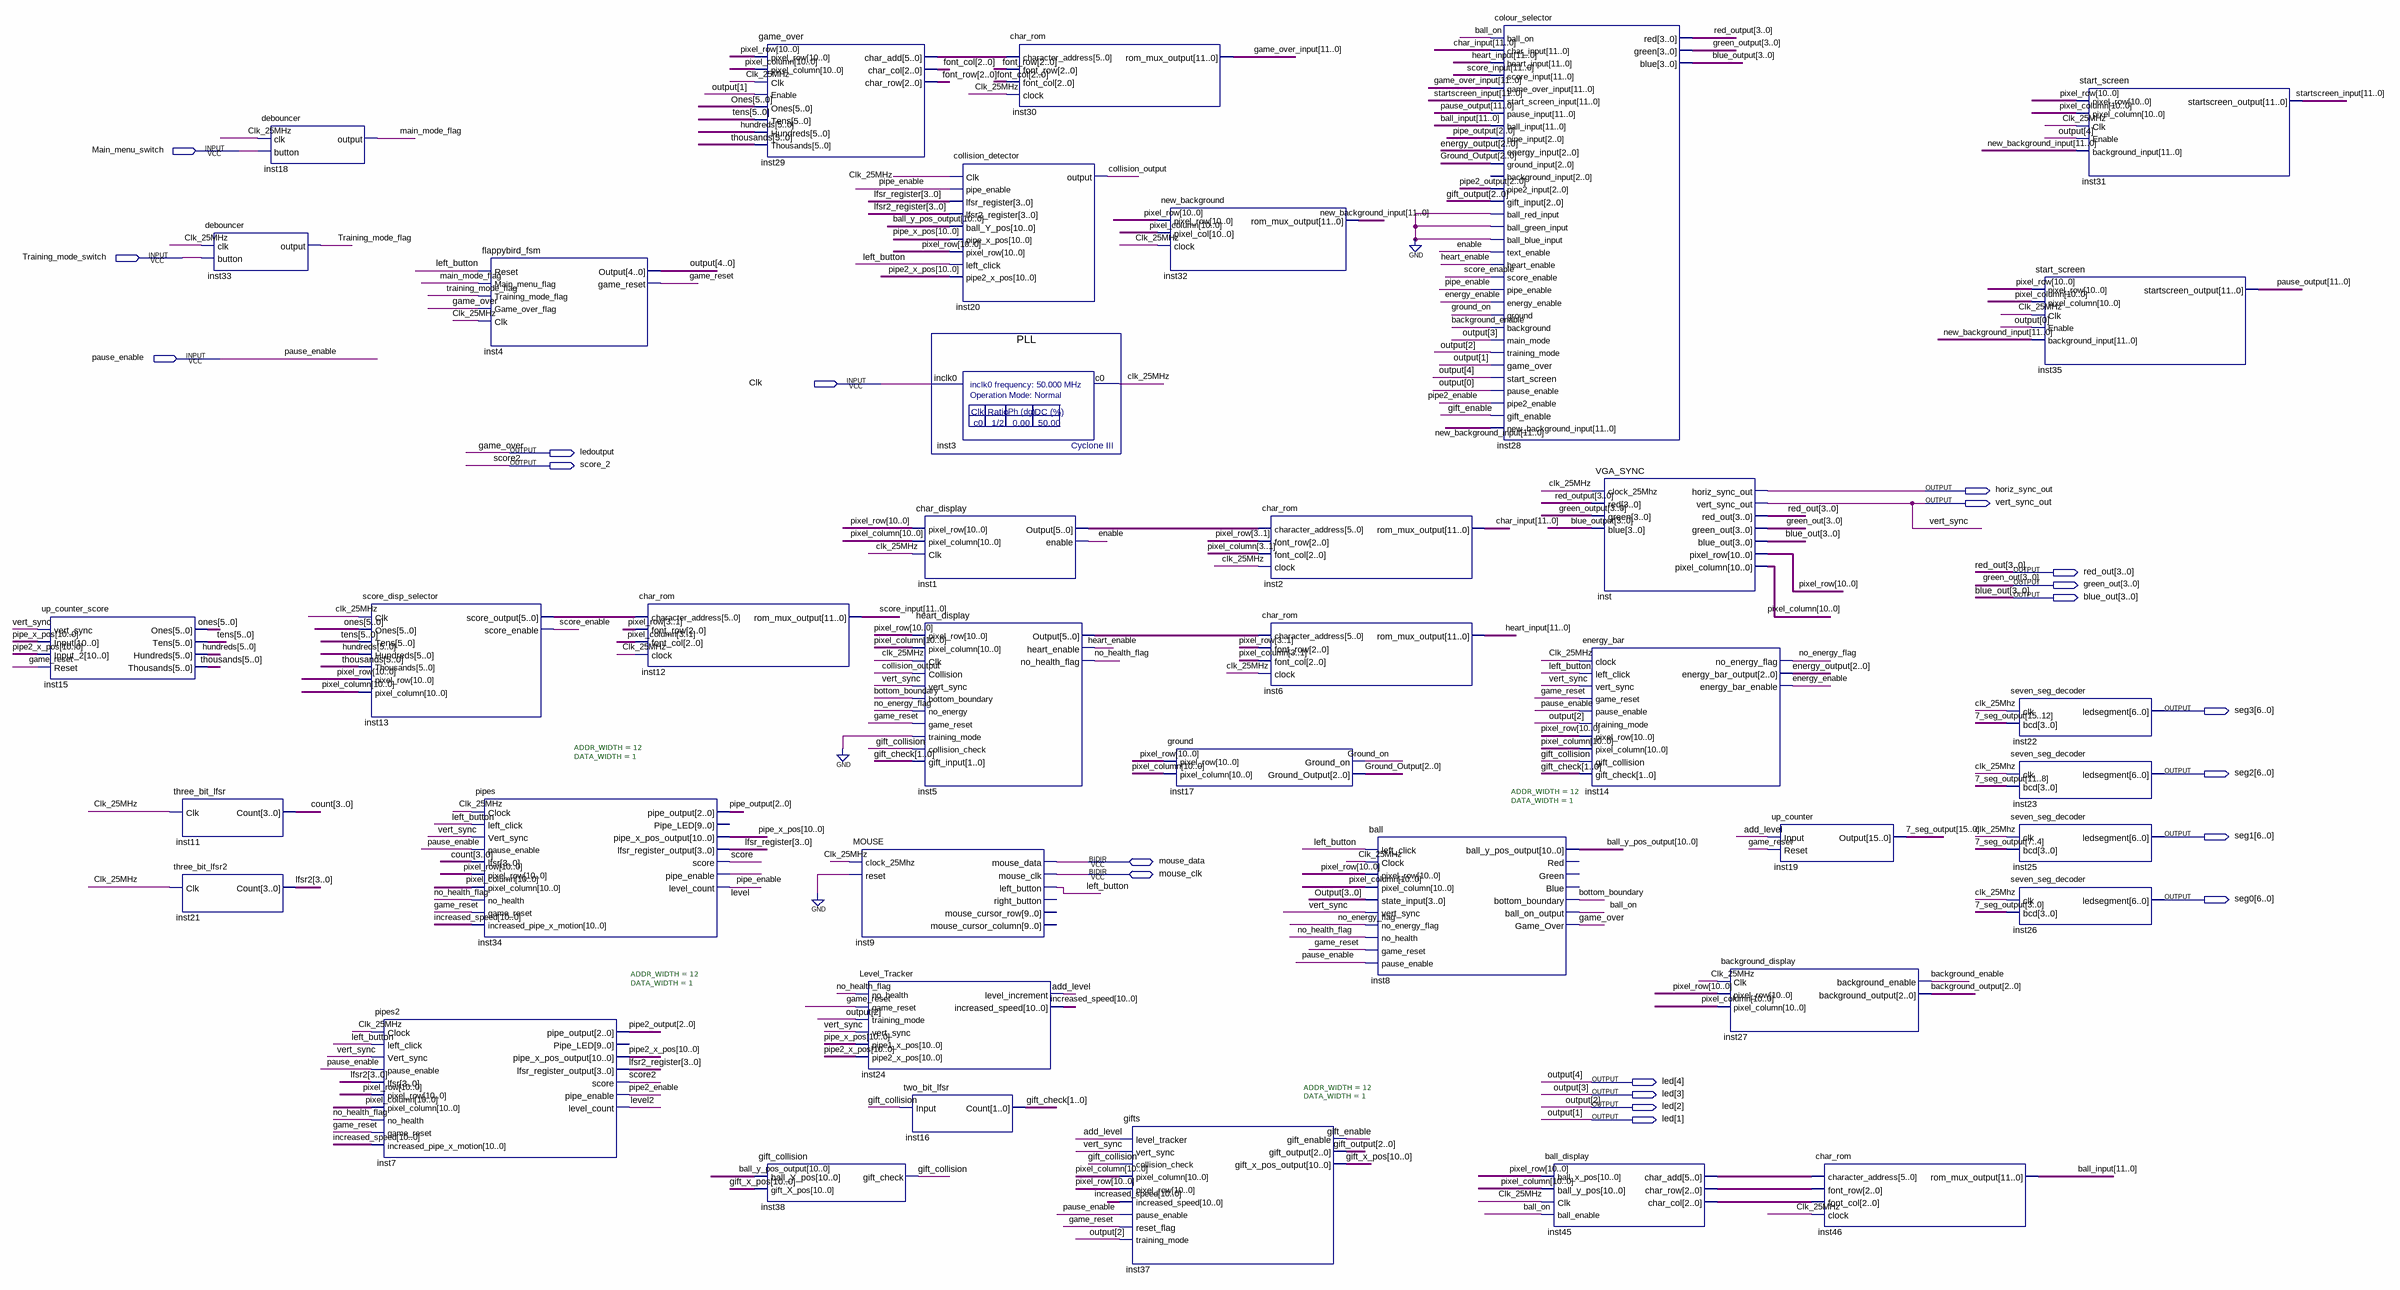
[diagram p0: schematic sheet]
// Quartus schematic Flappy_bird.bdf as structural Verilog: 39 symbols, 21 pins
module Flappy_bird (
  input  Main_menu_switch,
  input  Training_mode_switch,
  input  pause_enable,
  input  Clk,
  inout  mouse_data,
  inout  mouse_clk,
  output ledoutput,
  output score_2,
  output horiz_sync_out,
  output vert_sync_out,
  output [3:0] red_out,
  output [3:0] green_out,
  output [3:0] blue_out,
  output [6:0] seg3,
  output [6:0] seg2,
  output [6:0] seg1,
  output [6:0] seg0,
  output [4:1] led
);

  wire add_level, background_enable, ball_on, bottom_boundary, clk_25MHz, collision_output, enable,
       energy_enable, game_reset, gift_collision, gift_enable, Ground_on, heart_enable, left_button, level,
       level2, main_mode_flag, no_energy_flag, no_health_flag, pipe2_enable, pipe_enable, score,
       score_enable, Training_mode_flag;
  wire [0:0] Output;
  wire [1:0] gift_check;
  wire [2:0] background_output, energy_output, font_col, font_row, gift_output, Ground_Output,
       inst45_char_col, inst45_char_row, pipe2_output, pipe_output;
  wire [3:0] blue_output, count, green_output, lfsr2, lfsr2_register, lfsr_register, red_output;
  wire [5:0] hundreds, inst1_output, inst5_output, inst13_score_output, inst29_char_add, inst45_char_add,
       ones, tens, thousands;
  wire [10:0] ball_y_pos_output, gift_x_pos, increased_speed, pipe2_x_pos, pipe_x_pos, pixel_column,
       pixel_row;
  wire [11:0] ball_input, char_input, game_over_input, heart_input, new_background_input, pause_output,
       score_input, startscreen_input;
  wire [15:0] \7_seg_output ;

  up_counter_score inst15 (
    .vert_sync(vert_sync_out), .Input(pipe_x_pos), .Input_2(pipe2_x_pos), .Reset(game_reset), .Ones(ones),
    .Tens(tens), .Hundreds(hundreds), .Thousands(thousands));
  debouncer inst33 (.clk(clk_25MHz), .button(Training_mode_switch), .\output (Training_mode_flag));
  three_bit_lfsr inst11 (.Clk(clk_25MHz), .Count(count));
  three_bit_lfsr2 inst21 (.Clk(clk_25MHz), .Count(lfsr2));
  debouncer inst18 (.clk(clk_25MHz), .button(Main_menu_switch), .\output (main_mode_flag));
  score_disp_selector inst13 (
    .Clk(clk_25MHz), .Ones(ones), .Tens(tens), .Hundreds(hundreds), .Thousands(thousands),
    .pixel_row(pixel_row), .pixel_column(pixel_column), .score_output(inst13_score_output),
    .score_enable(score_enable));
  pipes2 #(.ADDR_WIDTH(12), .DATA_WIDTH(1)) inst7 (
    .Clock(clk_25MHz), .left_click(left_button), .Vert_sync(vert_sync_out), .pause_enable(pause_enable),
    .lfsr(lfsr2), .pixel_row(pixel_row), .pixel_column(pixel_column), .no_health(no_health_flag),
    .game_reset(game_reset), .increased_pipe_x_motion(increased_speed), .pipe_output(pipe2_output),
    .pipe_x_pos_output(pipe2_x_pos), .lfsr_register_output(lfsr2_register), .score(score_2),
    .pipe_enable(pipe2_enable), .level_count(level2));  // open: Pipe_LED
  flappybird_fsm inst4 (
    .Reset(left_button), .Main_menu_flag(main_mode_flag), .Training_mode_flag(Training_mode_flag),
    .Game_over_flag(ledoutput), .Clk(clk_25MHz), .Output({led, Output[0]}), .game_reset(game_reset));
  pipes #(.ADDR_WIDTH(12), .DATA_WIDTH(1)) inst34 (
    .Clock(clk_25MHz), .left_click(left_button), .Vert_sync(vert_sync_out), .pause_enable(pause_enable),
    .lfsr(count), .pixel_row(pixel_row), .pixel_column(pixel_column), .no_health(no_health_flag),
    .game_reset(game_reset), .increased_pipe_x_motion(increased_speed), .pipe_output(pipe_output),
    .pipe_x_pos_output(pipe_x_pos), .lfsr_register_output(lfsr_register), .score(score),
    .pipe_enable(pipe_enable), .level_count(level));  // open: Pipe_LED
  char_rom inst12 (
    .character_address(inst13_score_output), .font_row(pixel_row[3:1]), .font_col(pixel_column[3:1]),
    .clock(clk_25MHz), .rom_mux_output(score_input));
  game_over inst29 (
    .pixel_row(pixel_row), .pixel_column(pixel_column), .Clk(clk_25MHz), .Enable(led[1]), .Ones(ones),
    .Tens(tens), .Hundreds(hundreds), .Thousands(thousands), .char_add(inst29_char_add), .char_col(font_col),
    .char_row(font_row));
  gift_collision inst38 (.ball_Y_pos(ball_y_pos_output), .gift_X_pos(gift_x_pos), .gift_check(gift_collision));
  MOUSE inst9 (
    .clock_25Mhz(clk_25MHz), .reset(1'b0), .left_button(left_button), .mouse_data(mouse_data),
    .mouse_clk(mouse_clk));  // open: right_button, mouse_cursor_row, mouse_cursor_column
  Level_Tracker inst24 (
    .no_health(no_health_flag), .game_reset(game_reset), .training_mode(led[2]), .vert_sync(vert_sync_out),
    .pipe1_x_pos(pipe_x_pos), .pipe2_x_pos(pipe2_x_pos), .level_increment(add_level),
    .increased_speed(increased_speed));
  two_bit_lfsr inst16 (.Input(gift_collision), .Count(gift_check));
  collision_detector inst20 (
    .Clk(clk_25MHz), .pipe_enable(pipe_enable), .lfsr_register(lfsr_register),
    .lfsr2_register(lfsr2_register), .ball_Y_pos(ball_y_pos_output), .pipe_x_pos(pipe_x_pos),
    .pixel_row(pixel_row), .left_click(left_button), .pipe2_x_pos(pipe2_x_pos), .\output (collision_output));
  PLL inst3 (.inclk0(Clk), .c0(clk_25MHz));
  char_display inst1 (
    .pixel_row(pixel_row), .pixel_column(pixel_column), .Clk(clk_25MHz), .Output(inst1_output),
    .enable(enable));
  heart_display inst5 (
    .pixel_row(pixel_row), .pixel_column(pixel_column), .Clk(clk_25MHz), .Collision(collision_output),
    .vert_sync(vert_sync_out), .bottom_boundary(bottom_boundary), .no_energy(no_energy_flag),
    .game_reset(game_reset), .training_mode(1'b0), .collision_check(gift_collision), .gift_input(gift_check),
    .Output(inst5_output), .heart_enable(heart_enable), .no_health_flag(no_health_flag));
  char_rom inst30 (
    .character_address(inst29_char_add), .font_row(font_row), .font_col(font_col), .clock(clk_25MHz),
    .rom_mux_output(game_over_input));
  new_background inst32 (
    .pixel_row(pixel_row), .pixel_col(pixel_column), .clock(clk_25MHz), .rom_mux_output(new_background_input));
  gifts #(.ADDR_WIDTH(12), .DATA_WIDTH(1)) inst37 (
    .level_tracker(add_level), .vert_sync(vert_sync_out), .collision_check(gift_collision),
    .pixel_column(pixel_column), .pixel_row(pixel_row), .increased_speed(increased_speed),
    .pause_enable(pause_enable), .reset_flag(game_reset), .training_mode(led[2]), .gift_enable(gift_enable),
    .gift_output(gift_output), .gift_x_pos_output(gift_x_pos));
  ground inst17 (
    .pixel_row(pixel_row), .pixel_column(pixel_column), .Ground_on(Ground_on), .Ground_Output(Ground_Output));
  char_rom inst2 (
    .character_address(inst1_output), .font_row(pixel_row[3:1]), .font_col(pixel_column[3:1]),
    .clock(clk_25MHz), .rom_mux_output(char_input));
  char_rom inst6 (
    .character_address(inst5_output), .font_row(pixel_row[3:1]), .font_col(pixel_column[3:1]),
    .clock(clk_25MHz), .rom_mux_output(heart_input));
  ball #(.ADDR_WIDTH(12), .DATA_WIDTH(1)) inst8 (
    .left_click(left_button), .Clock(clk_25MHz), .pixel_row(pixel_row), .pixel_column(pixel_column),
    .state_input({led[3:1], Output[0]}), .vert_sync(vert_sync_out), .no_energy_flag(no_energy_flag),
    .no_health(no_health_flag), .game_reset(game_reset), .pause_enable(pause_enable),
    .ball_y_pos_output(ball_y_pos_output), .bottom_boundary(bottom_boundary), .ball_on_output(ball_on),
    .Game_Over(ledoutput));  // open: Red, Green, Blue
  colour_selector inst28 (
    .ball_on(ball_on), .char_input(char_input), .heart_input(heart_input), .score_input(score_input),
    .game_over_input(game_over_input), .start_screen_input(startscreen_input), .pause_input(pause_output),
    .ball_input(ball_input), .pipe_input(pipe_output), .energy_input(energy_output),
    .ground_input(Ground_Output), .pipe2_input(pipe2_output), .gift_input(gift_output),
    .ball_red_input(1'b0), .ball_green_input(1'b0), .ball_blue_input(1'b0), .text_enable(enable),
    .heart_enable(heart_enable), .score_enable(score_enable), .pipe_enable(pipe_enable),
    .energy_enable(energy_enable), .ground(Ground_on), .background(background_enable), .main_mode(led[3]),
    .training_mode(led[2]), .game_over(led[1]), .start_screen(led[4]), .pause_enable(Output[0]),
    .pipe2_enable(pipe2_enable), .gift_enable(gift_enable), .new_background_input(new_background_input),
    .red(red_output), .green(green_output), .blue(blue_output));  // open: background_input
  ball_display inst45 (
    .ball_x_pos(pixel_row), .ball_y_pos(pixel_column), .Clk(clk_25MHz), .ball_enable(ball_on),
    .char_add(inst45_char_add), .char_row(inst45_char_row), .char_col(inst45_char_col));
  VGA_SYNC inst (
    .clock_25Mhz(clk_25MHz), .red(red_output), .green(green_output), .blue(blue_output),
    .horiz_sync_out(horiz_sync_out), .vert_sync_out(vert_sync_out), .red_out(red_out), .green_out(green_out),
    .blue_out(blue_out), .pixel_row(pixel_row), .pixel_column(pixel_column));
  energy_bar inst14 (
    .clock(clk_25MHz), .left_click(left_button), .vert_sync(vert_sync_out), .game_reset(game_reset),
    .pause_enable(pause_enable), .training_mode(led[2]), .pixel_row(pixel_row), .pixel_column(pixel_column),
    .gift_collision(gift_collision), .gift_check(gift_check), .no_energy_flag(no_energy_flag),
    .energy_bar_output(energy_output), .energy_bar_enable(energy_enable));
  background_display inst27 (
    .Clk(clk_25MHz), .pixel_row(pixel_row), .pixel_column(pixel_column),
    .background_enable(background_enable), .background_output(background_output));
  up_counter inst19 (.Input(add_level), .Reset(game_reset), .Output(\7_seg_output ));
  char_rom inst46 (
    .character_address(inst45_char_add), .font_row(inst45_char_row), .font_col(inst45_char_col),
    .clock(clk_25MHz), .rom_mux_output(ball_input));
  seven_seg_decoder inst22 (.clk(clk_25MHz), .bcd(\7_seg_output [15:12]), .ledsegment(seg3));
  seven_seg_decoder inst23 (.clk(clk_25MHz), .bcd(\7_seg_output [11:8]), .ledsegment(seg2));
  seven_seg_decoder inst25 (.clk(clk_25MHz), .bcd(\7_seg_output [7:4]), .ledsegment(seg1));
  seven_seg_decoder inst26 (.clk(clk_25MHz), .bcd(\7_seg_output [3:0]), .ledsegment(seg0));
  start_screen inst35 (
    .pixel_row(pixel_row), .pixel_column(pixel_column), .Clk(clk_25MHz), .Enable(Output[0]),
    .background_input(new_background_input), .startscreen_output(pause_output));
  start_screen inst31 (
    .pixel_row(pixel_row), .pixel_column(pixel_column), .Clk(clk_25MHz), .Enable(led[4]),
    .background_input(new_background_input), .startscreen_output(startscreen_input));

  // Other names for the same wires on the sheet: game_over = ledoutput; Output[4:1] = led; score2 = score_2;
  //   vert_sync = vert_sync_out
endmodule
